# Altium schematic sheet config-bank6.SchDoc: Config FPGA - Bank 6
size Letter; CompanyName: Brinton Engineering, LLC; Address1: 3479 Edison Way; Address2: Menlo Park CA 94025; Address3: +1 (877) 778-8435; Address4: brintonengineering.com; Revision: 1; SheetNumber: 1; SheetTotal: 1
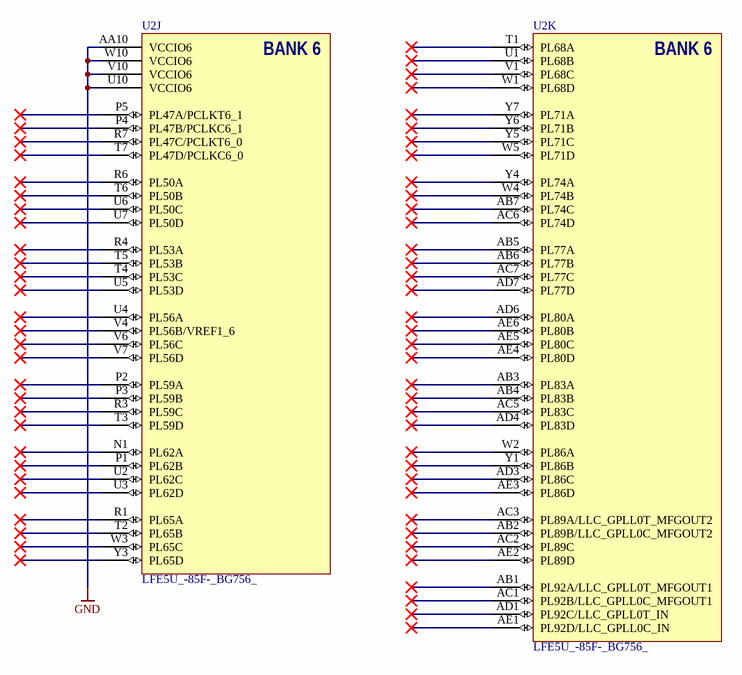
[diagram p0: config-bank6.SchDoc]

## Parts
U2  LFE5U_-85F-_BG756_  [caBGA756]  (parts J,K of 19)

## Nets
GND: U2.AA10(VCCIO6) U2.U10(VCCIO6) U2.V10(VCCIO6) U2.W10(VCCIO6)

Not connected (* = marked no-connect by the designer): U2 AB1(PL92A/LLC_GPLL0T_MFGOUT1)* AB2(PL89B/LLC_GPLL0C_MFGOUT2)* AB3(PL83A)* AB4(PL83B)* AB5(PL77A)* AB6(PL77B)* AB7(PL74C)* AC1(PL92B/LLC_GPLL0C_MFGOUT1)* AC2(PL89C)* AC3(PL89A/LLC_GPLL0T_MFGOUT2)* AC5(PL83C)* AC6(PL74D)* AC7(PL77C)* AD1(PL92C/LLC_GPLL0T_IN)* AD3(PL86C)* AD4(PL83D)* AD6(PL80A)* AD7(PL77D)* AE1(PL92D/LLC_GPLL0C_IN)* AE2(PL89D)* AE3(PL86D)* AE4(PL80D)* AE5(PL80C)* AE6(PL80B)* N1(PL62A)* P1(PL62B)* P2(PL59A)* P3(PL59B)* P4(PL47B/PCLKC6_1)* P5(PL47A/PCLKT6_1)* R1(PL65A)* R3(PL59C)* R4(PL53A)* R6(PL50A)* R7(PL47C/PCLKT6_0)* T1(PL68A)* T2(PL65B)* T3(PL59D)* T4(PL53C)* T5(PL53B)* T6(PL50B)* T7(PL47D/PCLKC6_0)* U1(PL68B)* U2(PL62C)* U3(PL62D)* U4(PL56A)* U5(PL53D)* U6(PL50C)* U7(PL50D)* V1(PL68C)* V4(PL56B/VREF1_6)* V6(PL56C)* V7(PL56D)* W1(PL68D)* W2(PL86A)* W3(PL65C)* W4(PL74B)* W5(PL71D)* Y1(PL86B)* Y3(PL65D)* Y4(PL74A)* Y5(PL71C)* Y6(PL71B)* Y7(PL71A)*

## Notes on the sheet
- Title
- Engineer
- Revision
- Drawn By
- Checked By
- Date
- Sheet
- of
- (in symbol LFE5U_-85F-_BG756_, part J) BANK 6
- (in symbol LFE5U_-85F-_BG756_, part K) BANK 6

## Library data of the parts
U2 = LFE5U_-85F-_BG756_: ECP5 FPGA, 85k LUT, 756-caBGA; Manufacturer: Lattice Semiconductor; Manufacturer P/N: LFE5U_-85F-_BG756_